# Altium schematic sheet STM32F4 64LQFP.SchDoc
size 297 x 210 mm
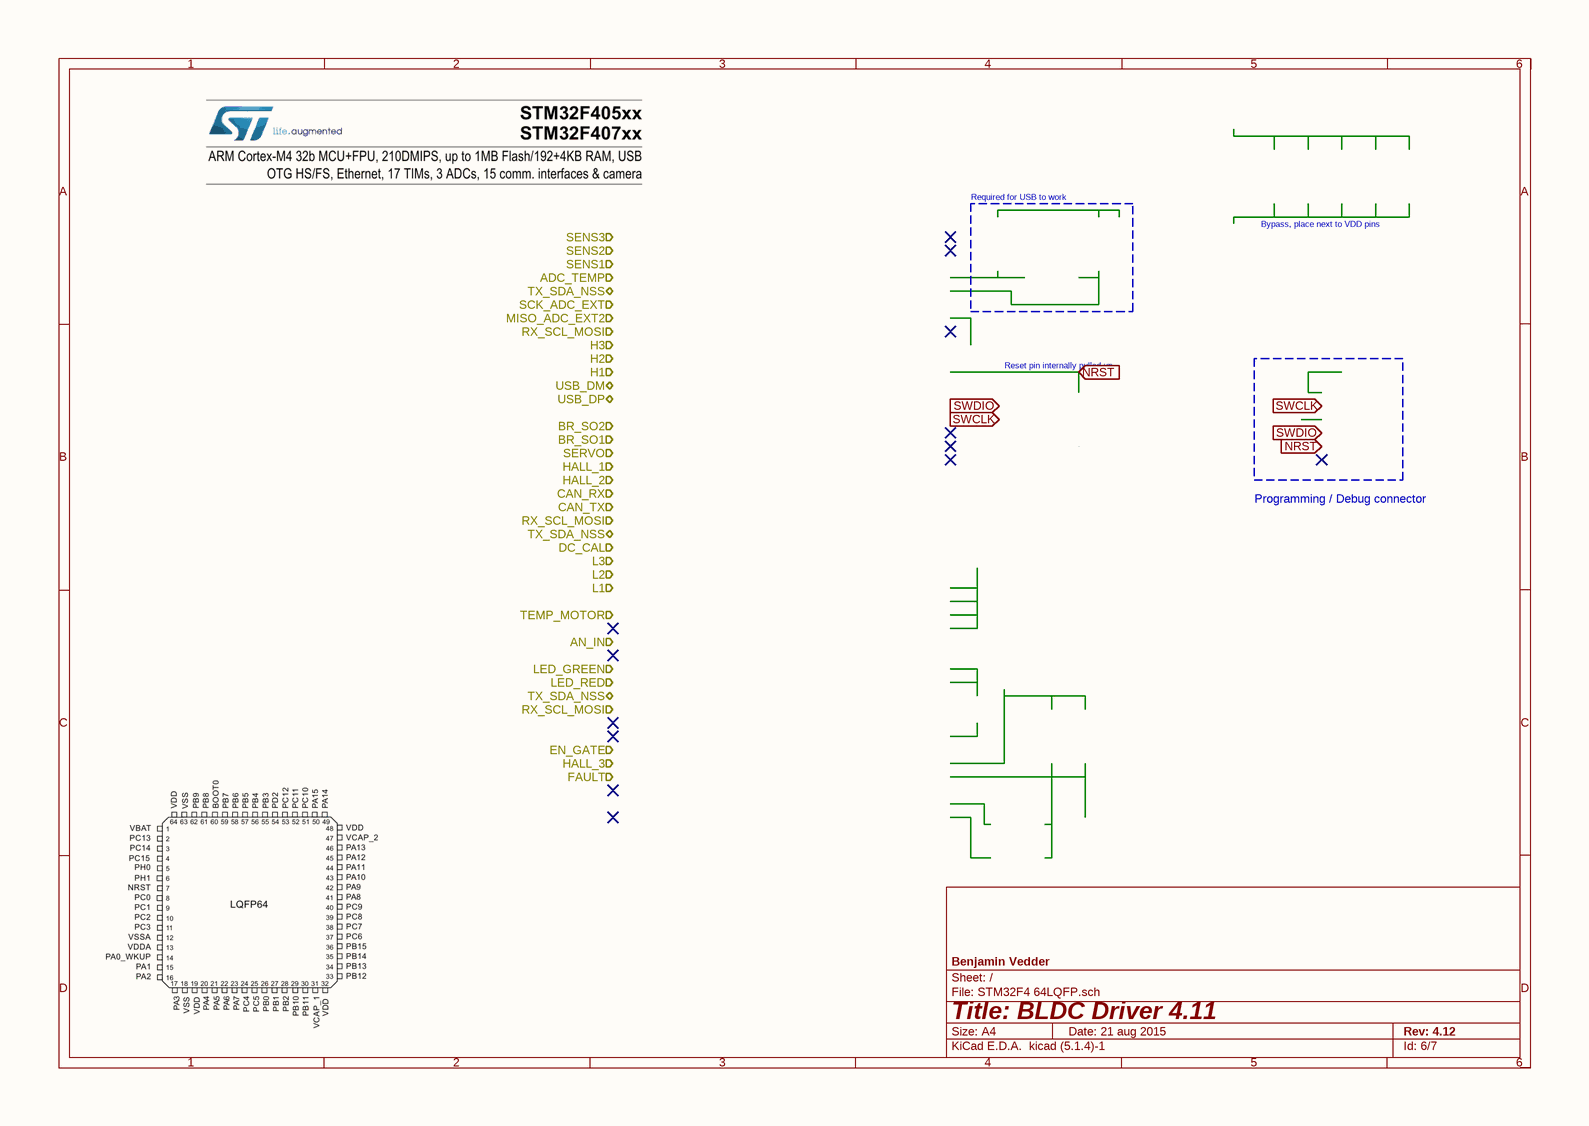
[diagram p0: STM32F4 64LQFP.SchDoc]

## Ports
ADC_TEMP (in), AN_IN (in), BR_SO1 (in), BR_SO2 (in), CAN_RX (in), CAN_TX (out), DC_CAL (in), EN_GATE (out), FAULT (in), H1 (out), H2 (out), H3 (out), HALL_1 (in), HALL_2 (in), HALL_3 (in), L1 (out), L2 (out), L3 (out), LED_GREEN (out), LED_RED (out), MISO_ADC_EXT2 (in), NRST (in), RX_SCL_MOSI (out), SCK_ADC_EXT (in), SENS1 (in), SENS2 (in), SENS3 (in), SERVO (out), SWCLK (in), SWDIO (in), TEMP_MOTOR (in), TX_SDA_NSS (bidir), USB_DM (bidir), USB_DP (bidir)

## Notes on the sheet
- Required for USB
  to work
- Bypass, place next to VDD pins
- Reset pin internally
  pulled up
- Programming / Debug
  connector
- 1
- 2
- 3
- 4
- 5
- 6
- A
- B
- C
- D
- Title: BLDC Driver 4.11
- File: STM32F4 64LQFP.sch
- Sheet: /
- Benjamin Vedder
- KiCad E.D.A.  kicad (5.1.4)-1
- Size: A4
- Date: 21 aug 2015
- Rev: 4.12
- Id: 6/7